# Altium schematic sheet SX1308_GTW_e381v02c_Power.SchDoc
size B; DrawnBy: Erik Fountain; DocumentNumber: 4; SheetNumber: 4; SheetTotal: 5; PageSetup: Record=PageOptions|CenterHorizontal=True|CenterVertical=True|PrintScale=0.72|XCorrection=1.00|YCorrection=1.00|PrintKind=0|BorderSize=5000000|LeftOffset=0|BottomOffset=0|Orientation=2|PaperLength=1000|PaperWidth=1000|Scale=100|PaperSource=7|PrintQuality=-4|MediaType=1|DitherType=10|PaperKind=Letter|PrintScaleMode=1
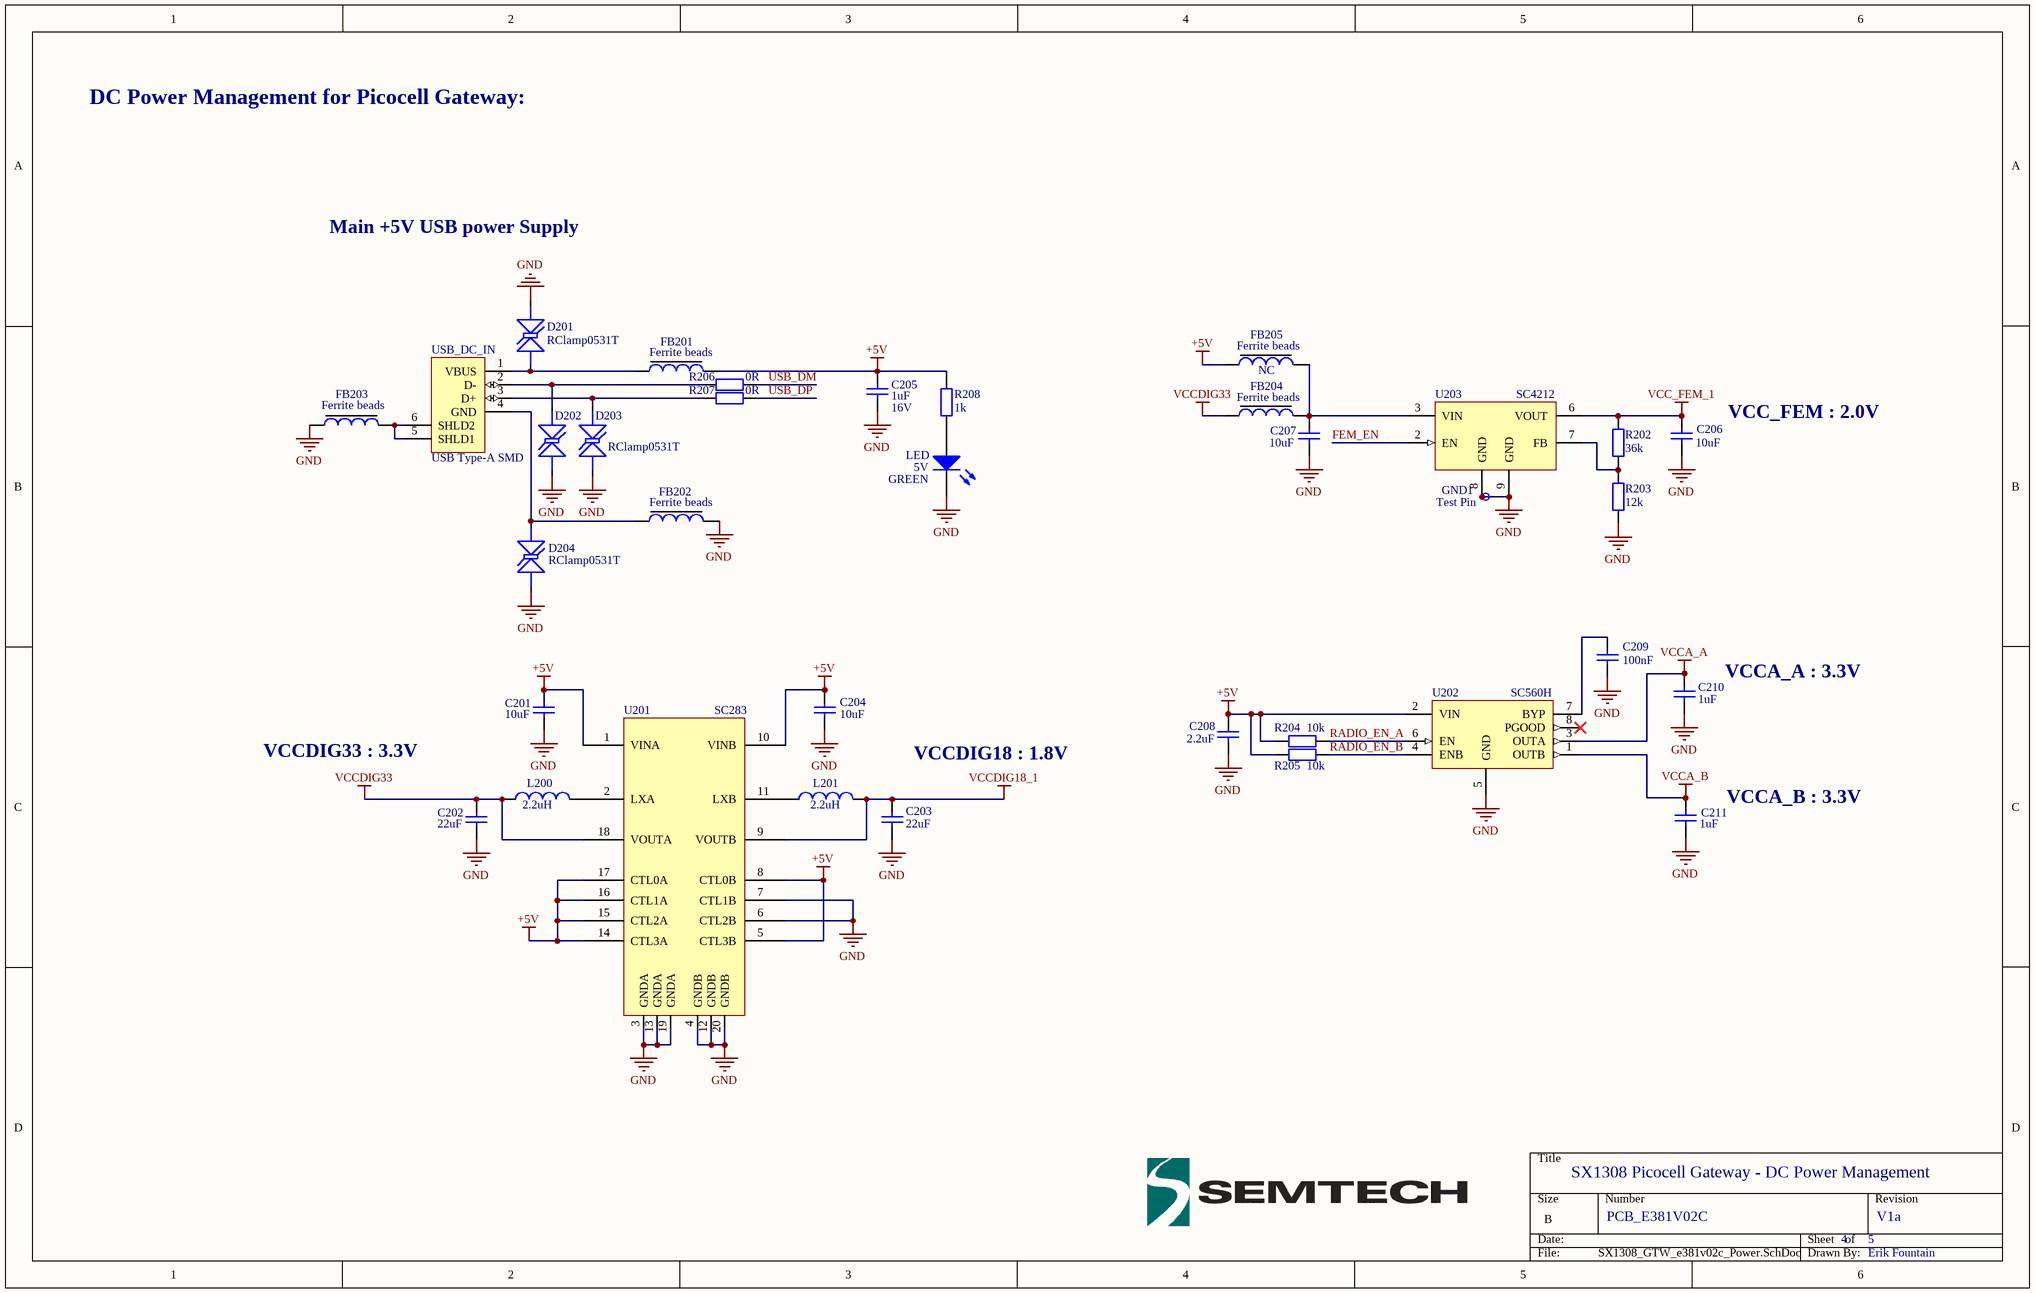
[diagram p0: SX1308_GTW_e381v02c_Power.SchDoc]

## Parts
5V  LED  Type: GREEN  [CD1608-0603]
C201  value 10uF  [C1206]  (hidden comment: Cap)
C202  value 22uF  [C1206]  (hidden comment: Cap)
C203  value 22uF  [C1206]  (hidden comment: Cap)
C204  value 10uF  [C1206]  (hidden comment: Cap)
C205  value 1uF  DC Voltage: 16V  [rlc_805_smd]  (hidden comment: Cap)
C206  value 10uF  [rlc_805_smd]  (hidden comment: Cap)
C207  value 10uF  [rlc_805_smd]  (hidden comment: Cap)
C208  value 2.2uF  [rlc_603_smd]  (hidden comment: Cap)
C209  value 100nF  [rlc_402_smd]  (hidden comment: Cap)
C210  value 1uF  [rlc_805_smd]  (hidden comment: Cap)
C211  value 1uF  [rlc_805_smd]  (hidden comment: Cap)
D201  RClamp0531T  [SLP1006P2T]
D202  RClamp0531T  [SLP1006P2T]  (value not drawn)
D203  RClamp0531T  [SLP1006P2T]
D204  RClamp0531T  [SLP1006P2T]
FB201  Ferrite beads  [rlc_402_smd]
FB202  Ferrite beads  [rlc_402_smd]
FB203  Ferrite beads  [rlc_402_smd]
FB204  Ferrite beads  [rlc_402_smd]
FB205  Ferrite beads  value NC  [rlc_402_smd]
GND1  Test Pin  [pin_1mm]
L200  value 2.2uH  [L4818]  (hidden comment: Inductor)
L201  value 2.2uH  [L4818]  (hidden comment: Inductor)
R202  value 36k  [rlc_402_smd]  (hidden comment: Resistor)
R203  value 12k  [rlc_402_smd]  (hidden comment: Resistor)
R204  value 10k  [rlc_402_smd]  (hidden comment: Resistor)
R205  value 10k  [rlc_402_smd]  (hidden comment: Resistor)
R206  value 0R  [rlc_402_smd]  (hidden comment: Resistor)
R207  value 0R  [rlc_402_smd]  (hidden comment: Resistor)
R208  value 1k  [rlc_402_smd]  (hidden comment: Resistor)
U201  SC283  [MLPQ-W18]
U202  SC560H  [MLPQ-UT8]
U203  SC4212  [MLPD-8 3x3mm]
USB_DC_IN  USB Type-A SMD  [Keystone USB Type 931]

## Nets
+5V: C201.1 C204.1 C205.1 C208.1 FB201.2 FB205.1 R204.1 R205.1 R208.1 U201.1(VINA) U201.5(CTL3B) U201.8(CTL0B) U201.10(VINB) U201.14(CTL3A) U201.15(CTL2A) U201.16(CTL1A) U201.17(CTL0A) U202.2(VIN)
GND: 5V.2(K) C201.2 C202.2 C203.2 C204.2 C205.2 C206.2 C207.2 C208.2 C209.1 C210.2 C211.2 D201.2(K) D202.2(K) D203.2(K) D204.2(K) FB202.2 FB203.1 GND1.1(pin) R203.2 U201.3(GNDA) U201.4(GNDB) U201.6(CTL2B) U201.7(CTL1B) U201.12(GNDB) U201.13(GNDA) U201.19(GNDA) U201.20(GNDB) U202.5(GND) U203.8(GND) U203.9(GND)
VCC_FEM_1: C206.1 R202.1 U203.6(VOUT)
VCCA_A: C210.1 U202.3(OUTA)
VCCA_B: C211.1 U202.1(OUTB)
VCCDIG18_1: C203.1 L201.2 U201.9(VOUTB)
VCCDIG33: C202.1 FB204.1 L200.1 U201.18(VOUTA)
FEM_EN: U203.2(EN)
RADIO_EN_A: R204.2 U202.6(EN)
RADIO_EN_B: R205.2 U202.4(ENB)
USB_DM: R206.2
USB_DP: R207.2
Net5V_1: 5V.1(A) R208.2
NetC207_1: C207.1 FB204.2 FB205.2 U203.3(VIN)
NetC209_2: C209.2 U202.7(BYP)
NetD201_1: D201.1(A) FB201.1 USB_DC_IN.1(VBUS)
NetD202_1: D202.1(A) R206.1 USB_DC_IN.2(D-)
NetD203_1: D203.1(A) R207.1 USB_DC_IN.3(D+)
NetD204_1: D204.1(A) FB202.1 USB_DC_IN.4(GND)
NetFB203_2: FB203.2 USB_DC_IN.5(SHLD1) USB_DC_IN.6(SHLD2)
NetL200_2: L200.2 U201.2(LXA)
NetL201_1: L201.1 U201.11(LXB)
NetR202_2: R202.2 R203.1 U203.7(FB)

Not connected (* = marked no-connect by the designer): U202 8(PGOOD)*

## Notes on the sheet
- DC Power Management for Picocell Gateway:
- Main +5V USB power Supply
- (near C206) VCC_FEM : 2.0V
- (near C210) VCCA_A : 3.3V
- VCCDIG33 : 3.3V
- VCCDIG18 : 1.8V
- (near C211) VCCA_B : 3.3V
- SX1308 Picocell Gateway - DC Power Management
- PCB_E381V02C
- V1a

## Library data of the parts
C201-C211 = Cap: Capacitor SMD; Published: 8-Jun-2000; LatestRevisionDate: 05-oct-2007  -  Semtech; LatestRevisionNote: Re-released for DXP Platform.; Publisher: Altium Limited
D201-D204 = RClamp0531T: Ultra Low Capacitance 1-line ESD Protection; LatestRevisionDate: 23-Aug-2016; Type: RClamp0531T
FB201 FB202 FB204 = Ferrite beads: Value: VAL?
GND1 = test_pin: LatestRevisionDate: 05-oct-2007  -  Semtech
L200 L201 = Inductor: Code_IEC: 1005; Published: 8-Jun-2000; LatestRevisionDate: 05-oct-2007  -  Semtech; LatestRevisionNote: Re-released for DXP Platform.; Publisher: Altium Limited; Code_JEITA: 0402
R202-R208 = Resistor: Resistor SMD - IEC symbol version; LatestRevisionDate: 27-Jul-20  -  Semtech
U201 = SC283: SC283 - Dual Channel 2.5MHz, 1.8A  Synchronous Step-Down Regulator
U202 = SC560H: SC560H - Dual Output Low Noise LDO  Linear Regulator
U203 = SC4212: SC4212 - Very Low Input /Very Low Dropout  1Amp Regulator With Enable; Value: ?
USB_DC_IN = USB Type-A SMD: USB 2.0 SMT, Type A, Receptacle, 4 Position
5V = LED: LatestRevisionDate: 05-oct-2007  -  Semtech